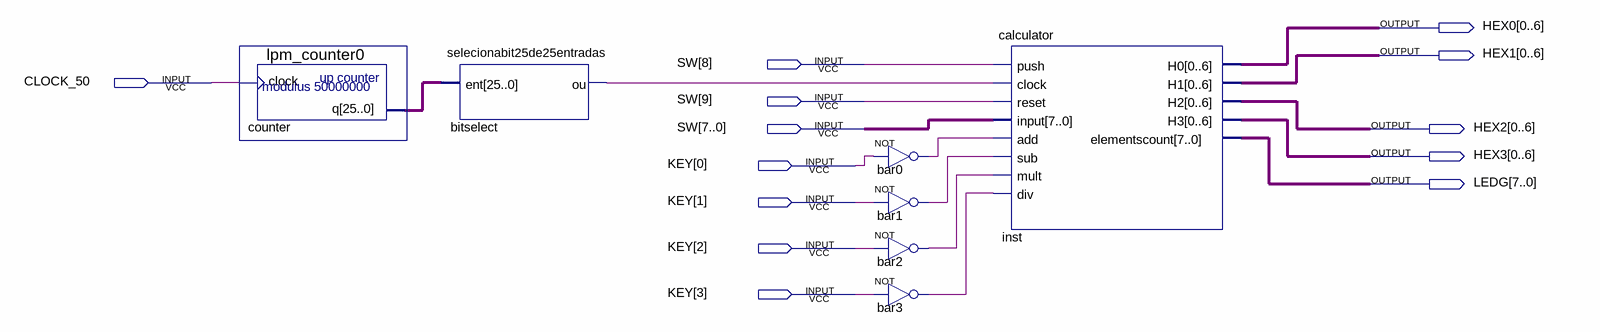
[diagram p0: schematic sheet]
// Quartus schematic np2.bdf as structural Verilog: 7 symbols, 13 pins
module np2 (
  input  [9:0] SW,
  input  CLOCK_50,
  input  [3:0] KEY,
  output [0:6] HEX0,
  output [0:6] HEX1,
  output [0:6] HEX2,
  output [0:6] HEX3,
  output [7:0] LEDG
);

  wire bar0_out, bar1_out, bar2_out, bar3_out, bitselect_ou;
  wire [25:0] counter_q;

  lpm_counter0 counter (.clock(CLOCK_50), .q(counter_q));
  selecionabit25de25entradas bitselect (.ent(counter_q), .ou(bitselect_ou));
  not bar0 (bar0_out, KEY[0]);
  not bar1 (bar1_out, KEY[1]);
  not bar2 (bar2_out, KEY[2]);
  not bar3 (bar3_out, KEY[3]);
  calculator inst (
    .push(SW[8]), .clock(bitselect_ou), .reset(SW[9]), .\input (SW[7:0]), .add(bar0_out), .sub(bar1_out),
    .mult(bar2_out), .div(bar3_out), .H0(HEX0), .H1(HEX1), .H2(HEX2), .H3(HEX3), .elementscount(LEDG));
endmodule
